# EAGLE design mapleSDuino-V0.9_014-eagle7-test (EAGLE 7.6.0)
MAPLE-CUx Large Version
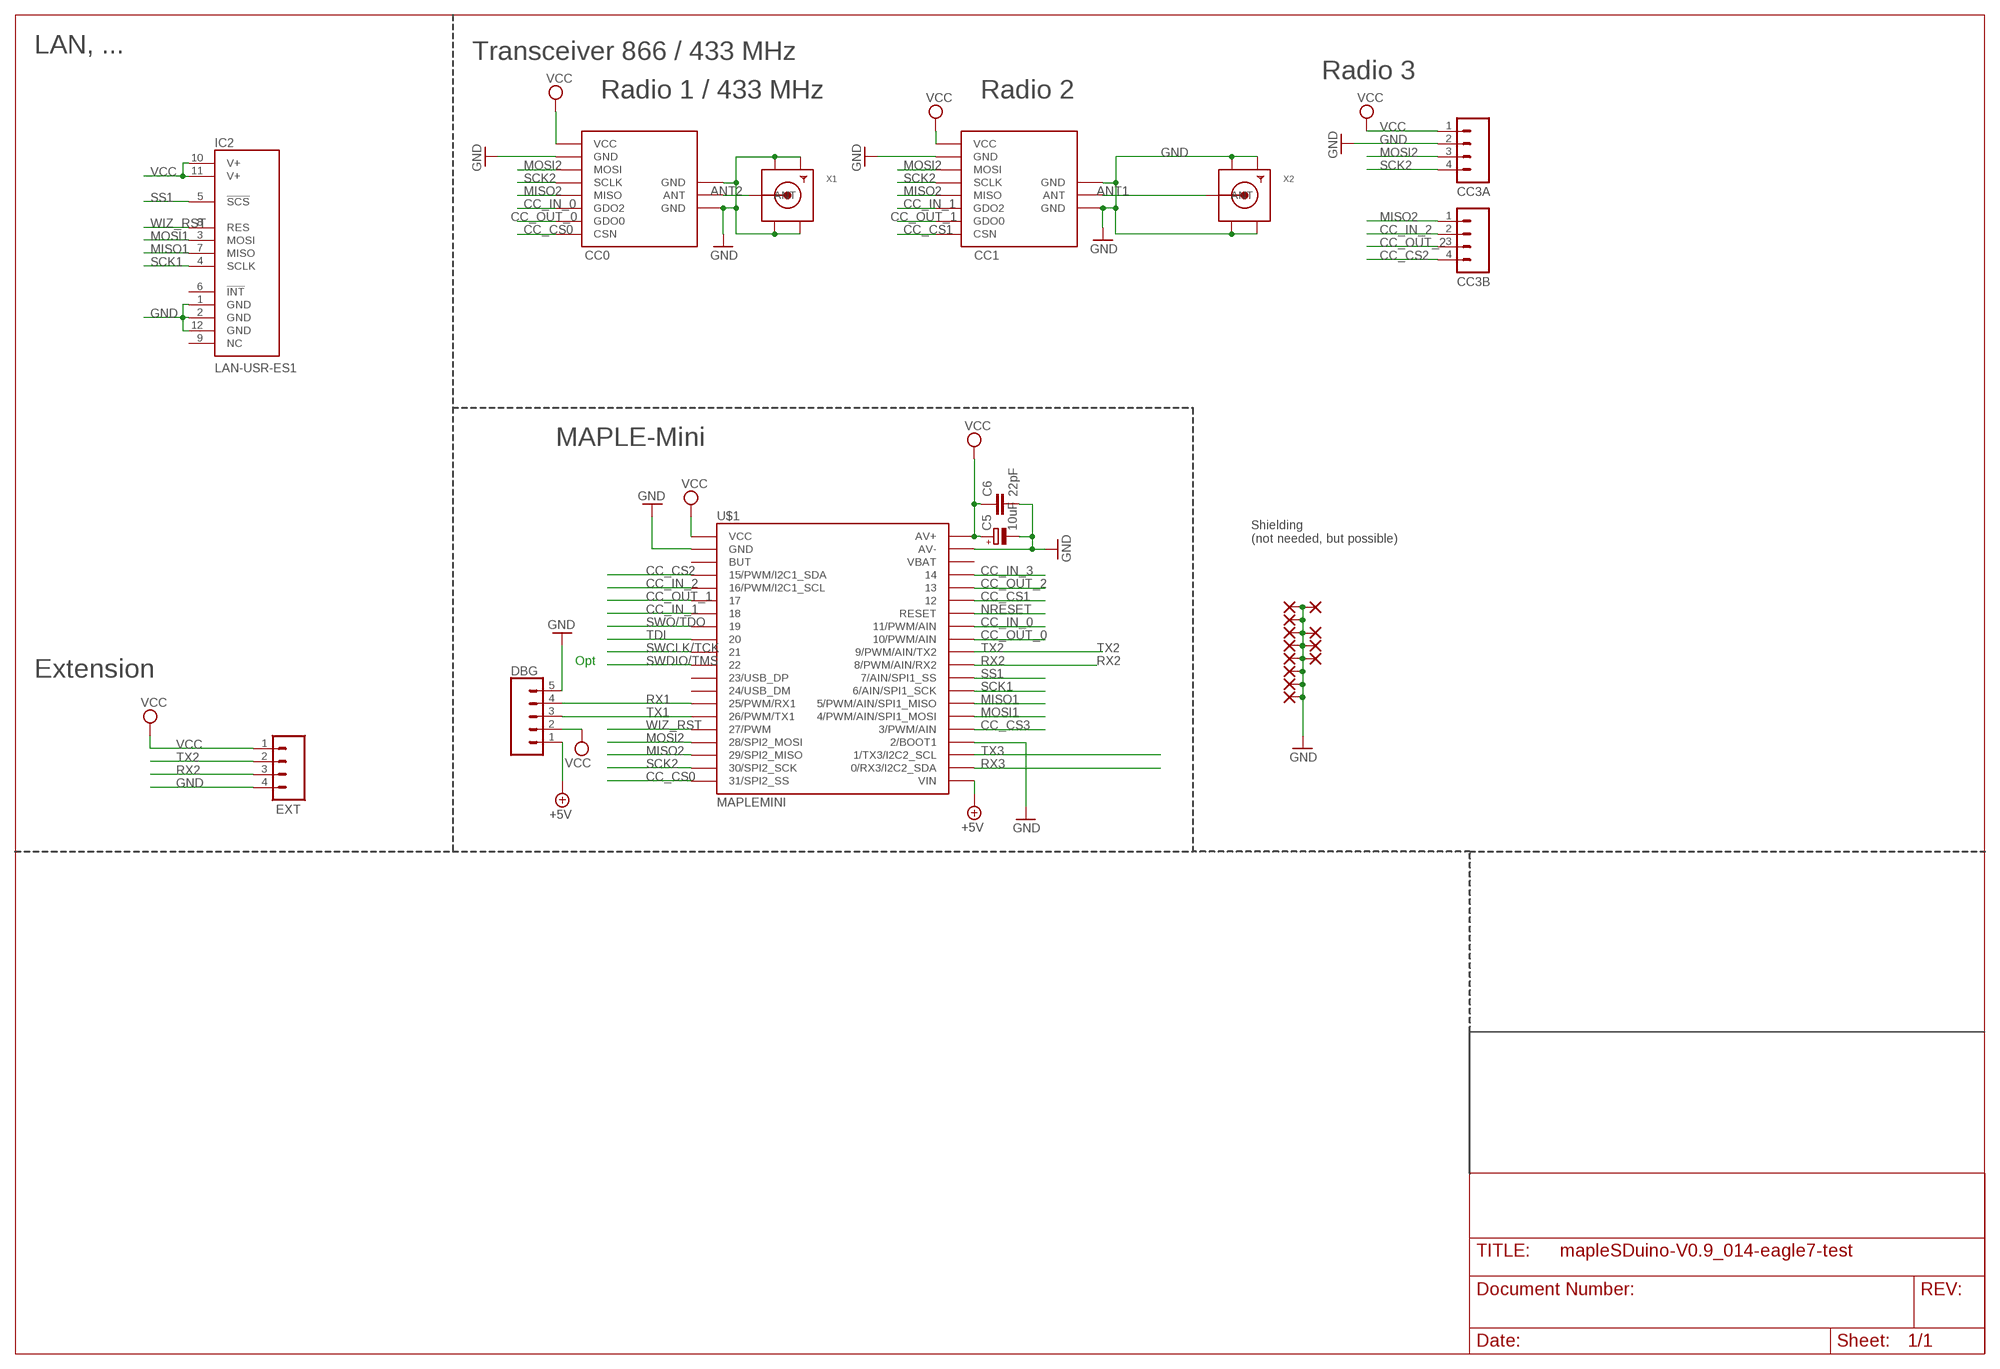
[diagram p0: schematic, sheet 1]

## Parts
C5  10uF  CPOL-EUR/2012-12W  [R/2012-12W]
C6  22pF  C-EUC0805  [C0805]
CC0  CC1101  CC1101_MODULE1SMD  [CC1101_MODULE1_SMD]
CC1  CC1101_MODULE1SMD  [CC1101_MODULE1_SMD]
CC3A  CONN_04PTH  [1X04]
CC3B  CONN_04PTH  [1X04]
DBG  CONN_05LOCK  [1X05_LOCK]
EXT  CONN_04PTH  [1X04]
IC2  LAN-USR-ES1  [USR-ES1]
PAD1  WIREPADSMD1,27-254  [SMD1,27-2,54]
PAD2  WIREPADSMD1,27-254  [SMD1,27-2,54]
PAD3  WIREPADSMD1,27-254  [SMD1,27-2,54]
PAD4  WIREPADSMD1,27-254  [SMD1,27-2,54]
PAD5  WIREPADSMD1,27-254  [SMD1,27-2,54]
PAD6  WIREPADSMD1,27-254  [SMD1,27-2,54]
PAD7  WIREPADSMD1,27-254  [SMD1,27-2,54]
PAD8  WIREPADSMD1,27-254  [SMD1,27-2,54]
PAD9  WIREPADSMD1,27-254  [SMD1,27-2,54]
PAD10  WIREPADSMD1,27-254  [SMD1,27-2,54]
PAD11  WIREPADSMD1,27-254  [SMD1,27-2,54]
PAD12  WIREPADSMD1,27-254  [SMD1,27-2,54]
U$1  MAPLEMINI  [20-DIP]
X1  SMACONNECTOR_EDGE  [SMA_EDGELAUNCH]
X2  SMACONNECTOR_EDGE  [SMA_EDGELAUNCH]

## Nets
+5V [PWR]: DBG.1 U$1.21(VIN)
ANT1 [PWR]: CC1.ANT X2.P(ANT)
ANT2: CC0.ANT X1.P(ANT)
CC_CS0: CC0.CSN U$1.20(31/SPI2_SS)
CC_CS1: CC1.CSN U$1.35
CC_CS2: CC3B.4 U$1.4(15/PWM/I2C1_SDA)
CC_CS3: U$1.25(3/PWM/AIN)
CC_IN_0: CC0.GDO2 U$1.33(11/PWM/AIN)
CC_IN_1: CC1.GDO2 U$1.7
CC_IN_2: CC3B.2 U$1.5(16/PWM/I2C1_SCL)
CC_IN_3: U$1.37
CC_OUT_0: CC0.GDO0 U$1.32(10/PWM/AIN)
CC_OUT_1: CC1.GDO0 U$1.6
CC_OUT_2: CC3B.3 U$1.36
GND [PWR]: C5.- C6.2 CC0.GND@0(GND) CC0.GND@1(GND) CC0.GND@2(GND) CC1.GND@0(GND) CC1.GND@1(GND) CC1.GND@2(GND) CC3A.2 DBG.5 EXT.4 IC2.1(GND) IC2.2(GND) IC2.12(GND) PAD1.1(P) PAD2.1(P) PAD3.1(P) PAD4.1(P) PAD5.1(P) PAD6.1(P) PAD7.1(P) PAD8.1(P) PAD9.1(P) PAD10.1(P) PAD11.1(P) PAD12.1(P) U$1.2(GND) U$1.24(2/BOOT1) U$1.39(AV-) X1.GND@1(GND4) X1.GND@2(GND3) X1.GND@3(GND2) X1.GND@4(GND1) X2.GND@1(GND4) X2.GND@2(GND3) X2.GND@3(GND2) X2.GND@4(GND1)
MISO1: IC2.7(MISO) U$1.27(5/PWM/AIN/SPI1_MISO)
MISO2: CC0.MISO CC1.MISO CC3B.1 U$1.18(29/SPI2_MISO)
MOSI1: IC2.3(MOSI) U$1.26(4/PWM/AIN/SPI1_MOSI)
MOSI2: CC0.MOSI CC1.MOSI CC3A.3 U$1.17(28/SPI2_MOSI)
NRESET: U$1.34(RESET)
RX1: DBG.4 U$1.14(25/PWM/RX1)
RX2: EXT.3 U$1.30(8/PWM/AIN/RX2)
RX3: U$1.22(0/RX3/I2C2_SDA)
SCK1: IC2.4(SCLK) U$1.28(6/AIN/SPI1_SCK)
SCK2: CC0.SCLK CC1.SCLK CC3A.4 U$1.19(30/SPI2_SCK)
SS1: IC2.5(!SCS!) U$1.29(7/AIN/SPI1_SS)
SWCLK/TCK: U$1.10
SWDIO/TMS: U$1.11
SWO/TDO: U$1.8
TDI: U$1.9
TX1: DBG.3 U$1.15(26/PWM/TX1)
TX2: EXT.2 U$1.31(9/PWM/AIN/TX2)
TX3: U$1.23(1/TX3/I2C2_SCL)
VCC [PWR]: C5.+ C6.1 CC0.VCC CC1.VCC CC3A.1 DBG.2 EXT.1 IC2.10(V+) IC2.11(V+) U$1.1(VCC) U$1.40(AV+)
WIZ_RST: IC2.8(RES) U$1.16(27/PWM)
Unconnected: IC2.6(!INT!) IC2.9(NC) U$1.3(BUT) U$1.12(23/USB_DP) U$1.13(24/USB_DM) U$1.38(VBAT)

## Notes on the sheet
- LAN, ... | Transceiver 866 / 433 MHz
- Radio 3
- Radio 1 / 433 MHz | Radio 2
- MAPLE-Mini
- Shielding
  (not needed, but possible)
- Opt
- Extension

## Library data of the parts
C5 = rcl:CPOL-EU: POLARIZED CAPACITOR, European symbol
C6 = rcl:C-EU: CAPACITOR, European symbol
CC0 CC1 = CC1101:CC1101_MODULE1: CC1101 wireless module for 433/868 MHz (sold from Aliexpress). DIL version for mounting with pin header (and SMD soldering) and SMD only variant available.
CC3A CC3B EXT = SparkFun-Connectors:CONN_04: Multi connection point. Often used as Generic Header-pin footprint for 0.1 inch spaced/style header connections On any of the 0.1 inch spaced packages, you can populate with these: Break Away Headers - Straight <https://www.sparkfun.com/products/116> (PRT-00116) Break Away Male Headers - Right Angle <https://www.sparkfun.com/products/553> (PRT-00553) Female Headers <https://www.sparkfun.com/products/115> (PRT-00115) Break Away Headers - Machine Pin <https://www.sparkfun.com/products/117> (PRT-00117) Break Away Female Headers - Swiss Machine Pin <https://www.sparkfun.com/products/743> (PRT-00743) For SCREWTERMINALS and SPRING TERMINALS visit here: Screw Terimnals on SparkFun.com <https://www.sparkfun.com/search/results?term=Screw+Terminals> (5mm/3.5mm/2.54mm spacing) This device is also useful as a general connection point to wire up your design to another part of your project. Our various solder wires solder well into these plated through hole pads. Hook-Up Wire - Assortment (Stranded, 22 AWG) <https://www.sparkfun.com/products/11375> (PRT-11375) Hook-Up Wire - Assortment (Solid Core, 22 AWG) <https://www.sparkfun.com/products/11367> (PRT-11367) View the entire wire category on our website here <https://www.sparkfun.com/categories/141> Special notes: Molex polarized connector foot print use with SKU : PRT-08231 with associated crimp pins and housings. 1MM SMD Version SKU: PRT-10208; PROD_ID: CONN-09696
DBG = SparkFun-Connectors:CONN_05: Multi connection point. Often used as Generic Header-pin footprint for 0.1 inch spaced/style header connections On any of the 0.1 inch spaced packages, you can populate with these: Break Away Headers - Straight <https://www.sparkfun.com/products/116> (PRT-00116) Break Away Male Headers - Right Angle <https://www.sparkfun.com/products/553> (PRT-00553) Female Headers <https://www.sparkfun.com/products/115> (PRT-00115) Break Away Headers - Machine Pin <https://www.sparkfun.com/products/117> (PRT-00117) Break Away Female Headers - Swiss Machine Pin <https://www.sparkfun.com/products/743> (PRT-00743) For SCREWTERMINALS and SPRING TERMINALS visit here: Screw Terimnals on SparkFun.com <https://www.sparkfun.com/search/results?term=Screw+Terminals> (5mm/3.5mm/2.54mm spacing) This device is also useful as a general connection point to wire up your design to another part of your project. Our various solder wires solder well into these plated through hole pads. Hook-Up Wire - Assortment (Stranded, 22 AWG) <https://www.sparkfun.com/products/11375> (PRT-11375) Hook-Up Wire - Assortment (Solid Core, 22 AWG) <https://www.sparkfun.com/products/11367> (PRT-11367) View the entire wire category on our website here <https://www.sparkfun.com/categories/141> Special notes: Molex polarized connector foot print use with SKU : PRT-08231 with associated crimp pins and housings. 1MM SMD Version SKU: PRT-10208
IC2 = Martin-Communication:LAN-USR-ES1
PAD1-PAD12 = wirepad:WIREPAD: Wire PAD connect wire on PCB
U$1 = maplemini-small:MAPLEMINI
X1 X2 = adafruit:SMACONNECTOR: SMA Connector 90° DIP SMA Connector, 50 Ohm (4UConnector: 07259)

## Net classes
0 default: width 0.305 mm
1 PWR: width 0.406 mm

## Board
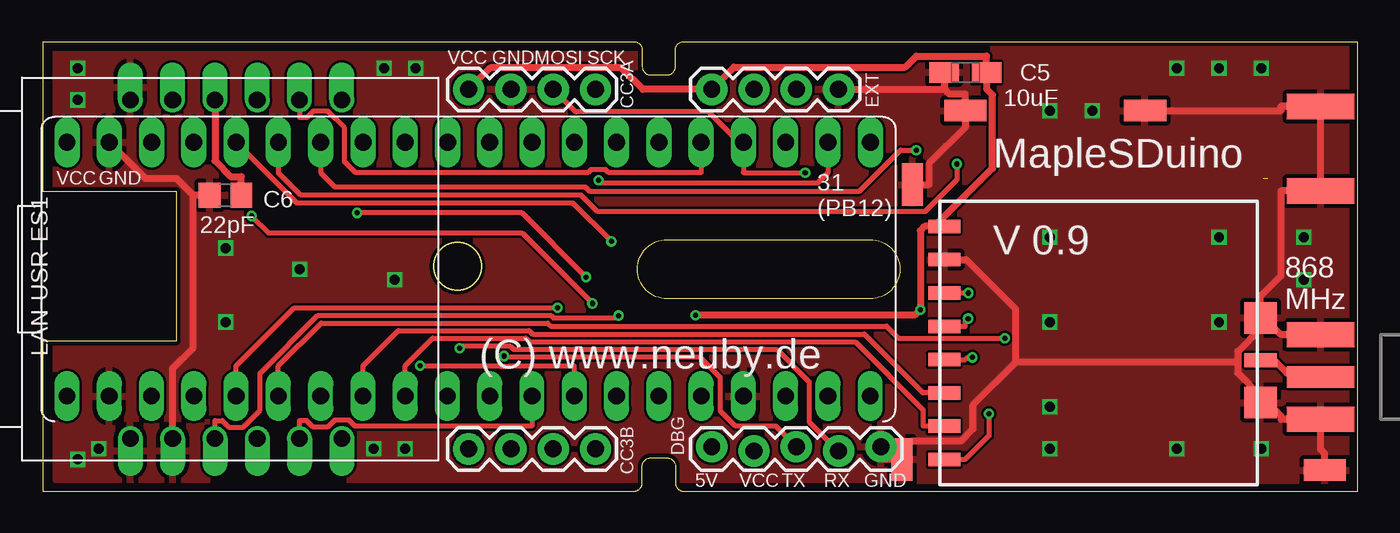
[diagram p1: board, top side]
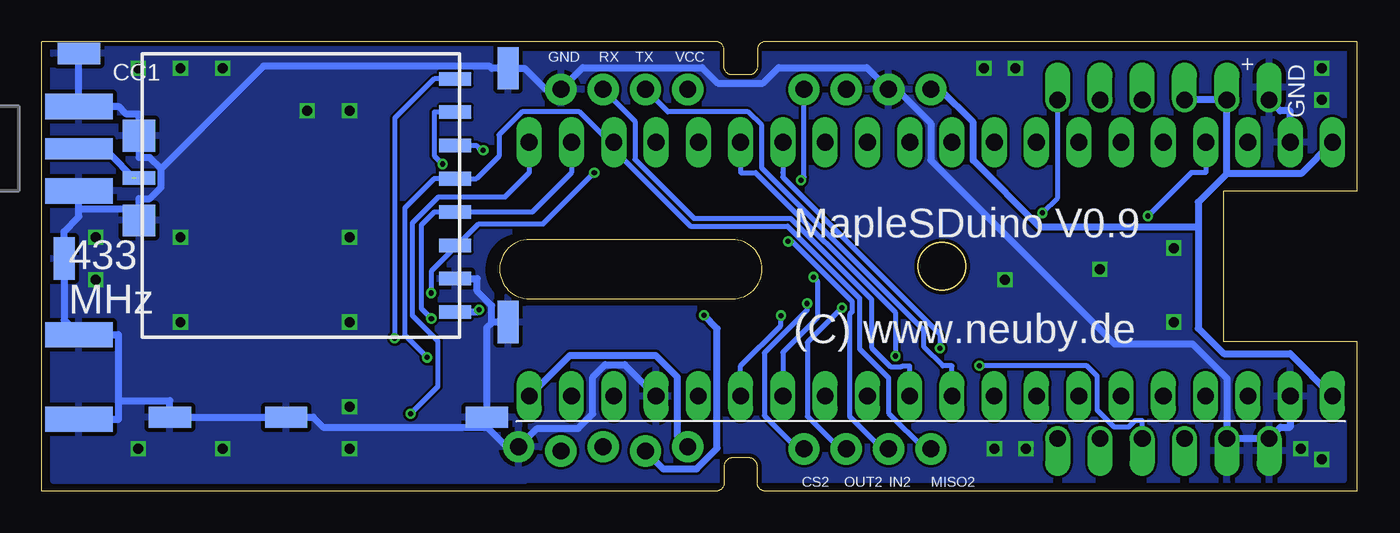
[diagram p2: board, bottom side, seen from below]

Size 79 x 27 mm. Coordinates in mm from the lower left corner, seen from the top.
Outline: 0,0 35.5,0 arc90 36,0.5 36,1.5 arc-90 36.5,2 37.5,2 arc-90 38,1.5 38,0.5 arc90 38.5,0 79,0 79,27 38.5,27 arc90 38,26.5 38,25.5 arc-90 37.5,25 36.5,25 arc-90 36,25.5 36,26.5 arc90 35.5,27 0,27 0,18 8,18 8,9 0,9 0,0
Outline: 37.5,15.11 49.7,15.11 arc-180 49.7,11.56 37.5,11.56 arc-180 37.5,15.11
Outline: circle at 24.9,13.51 radius 1.41
Copper layers (1*16): Top 0.035mm / dielectric 1.5mm / Bottom 0.035mm
Design rules "Fusion_eagle_rule_v1.1": minimum track width 6mil, minimum drill 12mil, track to track 6mil, track to pad 6mil, pad to pad 6mil, via to via 6mil, smd to smd 0mil, copper to edge 10mil, drill to drill 10mil, minimum pad ring 10mil, minimum via ring 6mil, stop-mask expansion 2mil, vias tented up to drill 100mil, thermal gap 10mil
tRestrict: 10 lines
bRestrict: 8 lines

### Footprints (pad centres in the part's own frame; a part is rotated, then mirrored left to right if it is on the bottom)
R/2012-12W = smd 1.75 x 1.26: + 1.275,0; - -1.275,0
C0805 = smd 1.3 x 1.5: 1 -0.95,0; 2 0.95,0
CC1101_MODULE1_SMD = smd 1.93 x 0.813: ANT 19,5.96; CSN 0,0; GDO0 0,2; GDO2 0,4; GND@0 0,12; MISO 0,6; MOSI 0,10; SCLK 0,8; VCC 0,14 | smd 1.93 x 1.905: GND@1 19,8.5; GND@2 19,3.42
1X04 = drill 1.016 pad 1.88: 1 0,0; 2 2.54,0; 3 5.08,0; 4 7.62,0
1X05_LOCK = drill 1.016 pad 1.88: 1 0,0.127; 2 2.54,-0.127; 3 5.08,0.127; 4 7.62,-0.127; 5 10.16,0.127
USR-ES1 = drill 1 pad 1.35 offset: 1 -10.16,5.715; 2 -10.16,3.175; 3 -10.16,0.635; 4 -10.16,-1.905; 5 -10.16,-4.445; 6 -10.16,-6.985; 7 10.16,-6.985; 8 10.16,-4.445; 9 10.16,-1.905; 10 10.16,0.635; 11 10.16,3.175; 12 10.16,5.715
SMD1,27-2,54 = smd 1.27 x 2.54: 1 0,0
20-DIP = drill 1.016 pad 1.27 long: 1 -24.13,-7.62; 2 -21.59,-7.62; 3 -19.05,-7.62; 4 -16.51,-7.62; 5 -13.97,-7.62; 6 -11.43,-7.62; 7 -8.89,-7.62; 8 -6.35,-7.62; 9 -3.81,-7.62; 10 -1.27,-7.62; 11 1.27,-7.62; 12 3.81,-7.62; 13 6.35,-7.62; 14 8.89,-7.62; 15 11.43,-7.62; 16 13.97,-7.62; 17 16.51,-7.62; 18 19.05,-7.62; 19 21.59,-7.62; 20 24.13,-7.62 | drill 1 pad 1.27 long: 21 24.13,7.62; 22 21.59,7.62; 23 19.05,7.62; 24 16.51,7.62; 25 13.97,7.62; 26 11.43,7.62; 27 8.89,7.62; 28 6.35,7.62; 29 3.81,7.62; 30 1.27,7.62; 31 -1.27,7.62; 32 -3.81,7.62; 33 -6.35,7.62; 34 -8.89,7.62; 35 -11.43,7.62; 36 -13.97,7.62; 37 -16.51,7.62; 38 -19.05,7.62; 39 -21.59,7.62; 40 -24.13,7.62
SMA_EDGELAUNCH = smd 4.064 x 1.524: GND@1 2.032,-2.54; GND@2 2.032,2.54 | smd 4.064 x 1.524 bottom: GND@3 2.032,2.54; GND@4 2.032,-2.54 | smd 4.064 x 1.27: P 2.032,0

### Placement (x,y rotation side)
C5  55.42,25.15 0 top
C6  10.97,17.78 180 top
CC0  54.15,1.91 0 top
CC1  54.15,24.77 180 bottom
CC3A  25.57,24.13 0 top
CC3B  25.57,2.54 0 top
DBG  40.18,2.54 0 top
EXT  40.18,24.13 0 top
IC2  10.97,13.34 90 top
PAD1  52.24,18.41 0 top
PAD2  77.01,1.27 90 top
PAD3  55.42,22.86 90 top
PAD4  71.3,4.45 270 bottom
PAD5  66.22,22.86 90 top
PAD6  51.61,1.91 0 top
PAD7  64.31,4.45 270 bottom
PAD8  50.98,10.16 0 bottom
PAD9  76.76,26.29 270 bottom
PAD10  77.64,13.97 0 bottom
PAD11  52.24,4.45 270 bottom
PAD12  50.98,25.4 180 bottom
U$1  25.57,13.34 180 bottom
X1  78.79,6.86 180 top
X2  78.79,20.57 0 bottom

### Tracks (layer width: path | path; a pad name or v marks a point on that pad's centre or on a via)
+5V
  Bottom 0.406: U$1.21 47.26,8.16 42.11,8.16 40.81,6.86 40.81,3.3 DBG.1
ANT1
  Bottom 0.406: CC1.ANT 73.46,18.8 74.85,20.19 76.38,20.19 X2.P
ANT2
  Top 0.406: CC0.ANT 73.97,7.87 74.72,7.11 76.5,7.11 X1.P
CC_CS0  (via drill 0.3 pad 0.61)
  Top 0.305: CC0.CSN 55.42,1.91 56.83,3.32 v56.83,4.65
  Bottom 0.305: v56.83,4.65 55.19,6.3 55.19,9.01 56.72,10.54 56.72,16.12 55.16,17.68 51.15,17.68 49.7,19.13 U$1.20
CC_CS1  (via drill 0.3 pad 0.61)
  Top 0.305: v57.78,9.19 51.4,9.19 50.68,9.91 30.52,9.91 30.33,10.1 16.72,10.1 14.14,7.53 U$1.35
  Bottom 0.305: v57.78,9.19 57.78,22.4 55.42,24.77 CC1.CSN
CC_CS2  (via drill 0.3 pad 0.61)
  Top 0.305: v12.53,16.53 13.55,15.51 28.77,15.51 v33.01,11.27
  Bottom 0.305: U$1.4 9.06,19.13 9.93,19.13 v12.53,16.53 | v33.01,11.27 33.01,10.88 35.58,8.3 35.58,4.54 33.58,2.54 CC3B.4
CC_IN_0
  Top 0.305: CC0.GDO2 52.88,5.91 49.35,9.43 29.42,9.43 29.2,9.64 21.34,9.64 19.23,7.53 U$1.33
CC_IN_1  (via drill 0.3 pad 0.61)
  Top 0.305: U$1.7 16.68,19.13 17.53,18.28 32.58,18.28 32.84,18.03 49.07,18.03 51.52,20.48 v52.47,20.48
  Bottom 0.305: CC1.GDO2 52.88,20.77 52.6,20.48 v52.47,20.48
CC_IN_2  (via drill 0.3 pad 0.61)
  Top 0.305: U$1.5 15.24,17.32 31.83,17.32 v34.15,15
  Bottom 0.305: v34.15,15 33.91,15 30.31,11.4 30.31,10.76 30.46,10.62 30.46,4.49 28.51,2.54 CC3B.2
CC_OUT_0
  Top 0.305: CC0.GDO0 52.88,3.9 52.88,4.9 48.8,8.97 29.23,8.97 29.02,9.19 23.42,9.19 21.77,7.53 U$1.32
CC_OUT_1  (via drill 0.3 pad 0.61)
  Top 0.305: v54.91,19.65 54.91,18.71 53,16.8 33.32,16.8 32.34,17.78 15.49,17.78 14.14,19.13 U$1.6
  Bottom 0.305: v54.91,19.65 55.42,20.16 55.42,22.77 CC1.GDO0
CC_OUT_2  (via drill 0.3 pad 0.61)
  Top 0.305: U$1.36 11.61,7.53 15.09,11.02 v30.92,11.02
  Bottom 0.305: v30.92,11.02 33,8.94 33,4.49 31.05,2.54 CC3B.3
GND  (via drill 0.6)
  Top 0.406: 71.78,7.74 71.78,7.1 73.15,5.74 | 73.15,9.75 71.78,8.38 71.78,7.74 | 58.44,7.74 58.44,10.93 55.47,13.9 CC0.GND@0 | 51.12,1.91 52.24,3.03 55.17,3.03 55.88,3.74 55.88,5.18 58.44,7.74 | 71.78,7.74 58.44,7.74 | 51.12,1.91 50.62,1.91 50.62,2.39 DBG.5 | PAD6.1 51.12,1.91 | 73.15,9.75 74.02,9.75 74.37,9.4 X1.GND@1 | 54.15,24.16 54.45,23.85 55.42,23.85 PAD3.1 55.42,21.87 53.24,19.68 53.24,18.41 PAD1.1 | EXT.4 54.12,24.13 54.15,24.16 | C5.- 54.15,24.16 | PAD5.1 67.84,22.86 74.37,22.86 74.37,23.11 X2.GND@2 X2.GND@1 74.37,18.03 74.37,12.93 73.15,11.71 CC0.GND@1 73.15,9.75 | 73.15,5.74 74.37,4.52 74.37,4.32 X1.GND@2 76.76,2.52 77.01,2.26 77.01,1.35 PAD2.1 | IC2.2 7.79,7.37 9.01,8.59 9.01,17.78 | CC0.GND@2 73.15,5.74 | C6.2 9.01,17.78 | U$1.2 6.16,18.78 8.01,18.78 9.01,17.78
  Bottom 0.406: U$1.24 43.97,7.6 45.14,7.6 45.9,6.84 45.9,4.64 46.76,3.78 49.23,3.78 DBG.5 51.06,2.67 52.24,3.85 | 71.83,19.37 72.5,20.04 73.15,20.04 CC1.GND@2 73.15,22.65 73.91,22.65 74.37,23.11 X2.GND@2 PAD9.1 | 71.83,19.37 71.83,18.24 72.5,17.57 73.15,17.57 73.15,16.92 | 71.83,19.37 65.67,25.53 52.09,25.53 51.97,25.4 PAD12.1 50.48,25.4 49.98,25.4 48.71,24.13 EXT.4 46.5,25.43 39.32,25.43 38.39,24.5 35.67,24.5 34.73,25.44 29.43,25.44 CC3A.2 27.61,24.13 25.57,22.09 25.57,19.88 14.54,8.84 9.86,8.84 7.79,6.78 IC2.2 IC2.1 4.58,3.85 3.99,3.85 U$1.39 | 52.24,3.85 62.09,3.85 62.68,4.45 PAD7.1 PAD4.1 71.3,5.44 74.37,5.44 | 52.24,3.85 PAD11.1 52.24,9.84 51.92,10.16 | 51.92,10.16 51.97,10.16 51.97,11.15 52.83,12.01 52.83,12.77 CC1.GND@0 | PAD8.1 51.92,10.16 | 76.76,16.92 X2.GND@1 | 76.76,16.92 76.76,16.48 77.64,15.6 PAD10.1 77.64,10.29 X1.GND@1 74.37,9.4 74.37,5.44 | 73.15,16.92 76.76,16.92 | CC1.GND@1 73.15,16.92 | 74.37,5.44 74.37,4.32 X1.GND@2 | U$1.2 3.99,22.84 4.59,22.84 IC2.12
  other vias: 2.08,25.4 2.08,23.5 2.08,1.91 3.35,2.54 20.5,25.4 22.4,25.4 19.86,2.54 21.77,2.54 10.97,10.16 10.97,14.61 15.41,13.34 21.13,12.7 60.5,22.86 60.5,15.24 73.2,25.4 70.66,25.4 70.66,15.24 68.12,25.4 75.74,15.24 75.74,12.7 60.5,10.16 60.5,5.08 60.5,2.54 73.2,2.54 68.12,2.54 70.66,10.16 63.04,22.86
  pour Bottom: 78.28,26.67 0.81,26.67 0.81,0.64 78.28,0.64
  pour Top: 0.81,0.64 0.81,26.67 78.28,26.67 78.28,0.64
MISO1  (via drill 0.3 pad 0.61)
  Top 0.305: v32.64,12.86 28.79,16.71 v18.87,16.71
  Bottom 0.305: v32.64,12.86 32.4,12.62 32.4,10.4 34.47,8.34 U$1.27 | v18.87,16.71 17.95,17.63 IC2.7
MISO2  (via drill 0.3 pad 0.61)
  Top 0.305: CC0.MISO 55.42,7.91 55.55,8.03 v55.83,8.03
  Bottom 0.305: 44.62,20.72 44.62,20.52 40.03,15.92 34.19,15.92 29.86,11.59 29.86,8.55 28.11,6.81 28.11,4.69 25.97,2.54 CC3B.1 | U$1.18 44.62,20.72 | 44.62,20.72 46.69,22.78 50.15,22.78 51.53,21.41 51.53,20.12 52.88,18.77 CC1.MISO 55.42,18.77 57.17,17.01 57.17,9.38 v55.83,8.03
MOSI1  (via drill 0.3 pad 0.61)
  Top 0.305: v34.59,10.55 34.45,10.41 30.67,10.41 30.52,10.56 16.52,10.56 13.04,7.08 13.04,4.87 12.02,3.85 11.16,3.85 10.77,4.23 10.34,4.23 IC2.3
  Bottom 0.305: v34.59,10.55 34.59,9.94 37.01,7.53 U$1.26
MOSI2  (via drill 0.3 pad 0.61)
  Top 0.305: 42.09,20.66 42.09,20.69 39.99,22.78 32,22.78 CC3A.3 | 42.09,20.66 42.09,19.13 v45.8,19.13 | U$1.17 42.09,20.66 | v55.59,11.9 55.42,11.9 CC0.MOSI
  Bottom 0.305: 54.03,14.77 52.74,16.05 48.87,16.05 v45.8,19.13 | 54.03,14.77 55.59,13.2 v55.59,11.9 | CC1.MOSI 54.03,14.77
N$1  (1 unrouted)
RX1  (via drill 0.3 pad 0.61)
  Top 0.305: v25.03,8.58 25.18,8.73 28.07,8.73 28.28,8.52 44.09,8.52 46.03,6.58 46.03,4.19 DBG.4
  Bottom 0.305: v25.03,8.58 25.03,9.43 34.47,18.86 34.47,19.13 U$1.14
RX2
  Bottom 0.305: EXT.3 43.35,22.23 43.35,19.92 39.81,16.38 34,16.38 29.14,11.52 29.14,8.62 27.99,7.47 27.34,7.47 27.28,7.53 26.84,7.53 U$1.30
SCK1  (via drill 0.3 pad 0.61)
  Top 0.305: v22.65,7.53 27.44,7.53 27.46,7.51 28.03,7.51 28.05,7.53 31.92,7.53 U$1.28
  Bottom 0.305: v22.65,7.53 16.2,7.53 15.58,6.91 15.58,4.87 14.56,3.85 13.7,3.85 13.31,4.23 12.88,4.23 IC2.4
SCK2  (via drill 0.3 pad 0.61)
  Top 0.305: v55.58,10.37 55.42,10.2 55.42,9.9 CC0.SCLK | v33.39,18.68 33.56,18.51 46.55,18.51 47.16,19.13 U$1.19
  Bottom 0.305: v55.58,10.37 56.2,10.98 56.2,15.98 55.42,16.77 CC1.SCLK 49.53,16.77 47.16,19.13 U$1.19 | v33.39,18.68 33.2,18.88 CC3A.4
SS1
  Top 0.305: IC2.5 15.41,4.23 15.85,4.23 16.24,3.85 17.1,3.85 17.51,4.26 18.4,4.26 18.76,3.9 29.38,3.9 U$1.29
TX1  (via drill 0.3 pad 0.61)
  Top 0.305: DBG.3 44.02,3.9 41.62,3.9 40.71,4.82 40.71,6.82 39.49,8.04 27.79,8.04 v27.71,8.12
  Bottom 0.305: v27.71,8.12 27.71,10.74 36.1,19.13 37.01,19.13 U$1.15
TX2
  Bottom 0.305: U$1.31 24.3,7.53 24.86,7.53 25.98,8.66 25.98,9.66 35.73,19.41 35.73,21.96 36.56,22.78 41.37,22.78 EXT.2
VCC  (via drill 0.3 pad 0.61)
  Top 0.406: CC3A.1 26.87,25.43 34.74,25.43 36.04,24.13 EXT.1 41.52,25.47 51.81,25.47 52.48,26.13 56.7,26.13 C5.+ 56.7,24.16 57.05,23.81 57.05,19.39 53.56,15.9 | v39.22,10.57 52.38,10.57 v52.71,10.9 52.71,15.65 52.97,15.9 53.56,15.9 | CC0.VCC 53.56,15.9 | C6.1 11.92,18.89 11.29,18.89 10.34,19.84 IC2.10
  Bottom 0.406: 9.51,15.87 9.51,9.79 7.99,8.26 3.99,8.26 U$1.40 | 7.79,19.07 9.51,17.36 9.51,15.87 | 9.51,15.87 19.04,15.87 23.04,19.86 23.04,22.14 25.02,24.13 CC3A.1 | DBG.2 41.65,1.35 39.66,1.35 38.42,2.58 38.42,9.77 v39.22,10.57 | IC2.10 IC2.11 7.79,19.07 | CC1.VCC 52.83,10.77 52.83,10.79 v52.71,10.9 | U$1.1 3.33,19.07 7.79,19.07
WIZ_RST
  Top 0.305: IC2.8 15.41,22.44 15.85,22.44 16.24,22.82 17.11,22.82 18.12,21.82 18.12,19.79 18.78,19.13 32.74,19.13 32.93,19.31 33.8,19.31 33.99,19.13 39.55,19.13 U$1.16

### Text on the board
tNames: VCC | GND | MOSI | SCK | C5 | 10uF | 31 / (PB12) | VCC | GND | C6 | 22pF | MapleSDuino | V 0.9 | 868 / MHz | LAN-USR-ES1 | (C) www.neuby.de | 5V | VCC | TX | RX | GND
bNames: GND | + | VCC | TX | RX | GND | CC1 | MapleSDuino V0.9 | 433 / MHz | (C) www.neuby.de | MISO2 | IN2 | OUT2 | CS2